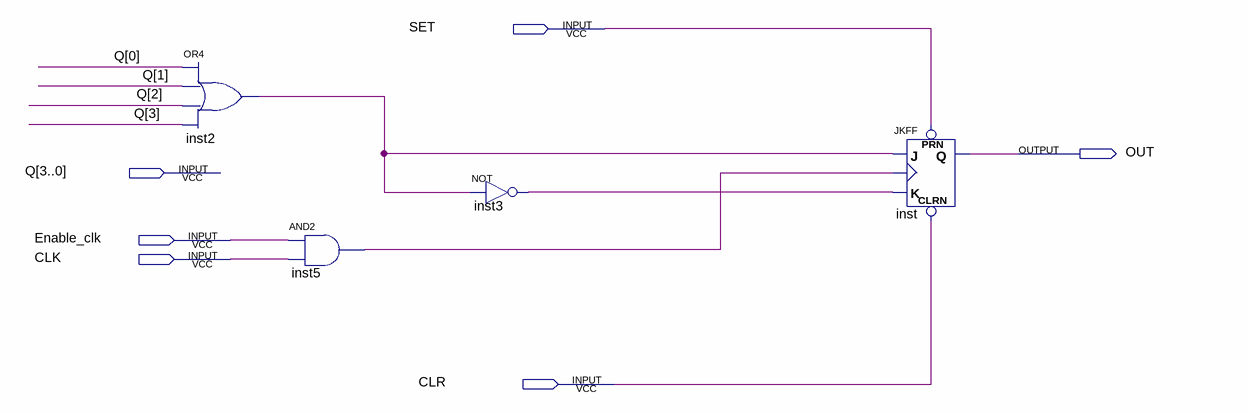
[diagram p0: schematic sheet]
// Quartus schematic Kstore.bdf as structural Verilog: 4 symbols, 6 pins
module Kstore (
  input  SET,
  input  [3:0] Q,
  input  Enable_clk,
  input  CLK,
  input  CLR,
  output OUT
);

  wire inst2_out, inst3_out, inst5_out;

  or inst2 (inst2_out, Q[0], Q[1], Q[2], Q[3]);
  and inst5 (inst5_out, Enable_clk, CLK);
  not inst3 (inst3_out, inst2_out);
  JKFF inst (.PRN(SET), .CLRN(CLR), .K(inst3_out), .J(inst2_out), .CLK(inst5_out), .Q(OUT));
endmodule
